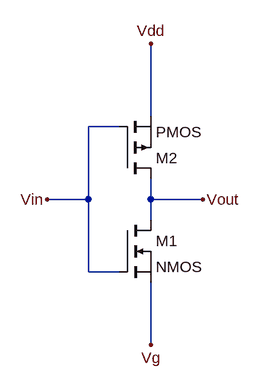
[diagram p0: schematic cmos.asc]
cmos.asc, the LTspice schematic file:
Version 4.1
SHEET 1 1148 680
WIRE 384 -32 384 -144
WIRE 336 -16 288 -16
WIRE 288 96 288 -16
WIRE 288 96 224 96
WIRE 384 96 384 64
WIRE 464 96 384 96
WIRE 384 128 384 96
WIRE 288 208 288 96
WIRE 336 208 288 208
WIRE 384 320 384 224
FLAG 384 -144 Vdd
FLAG 384 320 Vg
FLAG 224 96 Vin
FLAG 464 96 Vout
SYMBOL nmos 336 128 R0
SYMATTR InstName M1
SYMBOL pmos 336 64 M180
SYMATTR InstName M2

The netlist it stands for:
* cmos.asc
M1 Vout Vin Vg Vg NMOS
M2 Vout Vin Vdd Vdd PMOS
.model NMOS NMOS
.model PMOS PMOS
.lib standard.mos
.backanno
.end